# Altium schematic sheet УШЯИ.411522.033Э3_2.SCHDOC
size 420 x 297 mm; SheetNumber: 2; SheetTotal: 5; DocumentName: Sheet1.SCHDOC
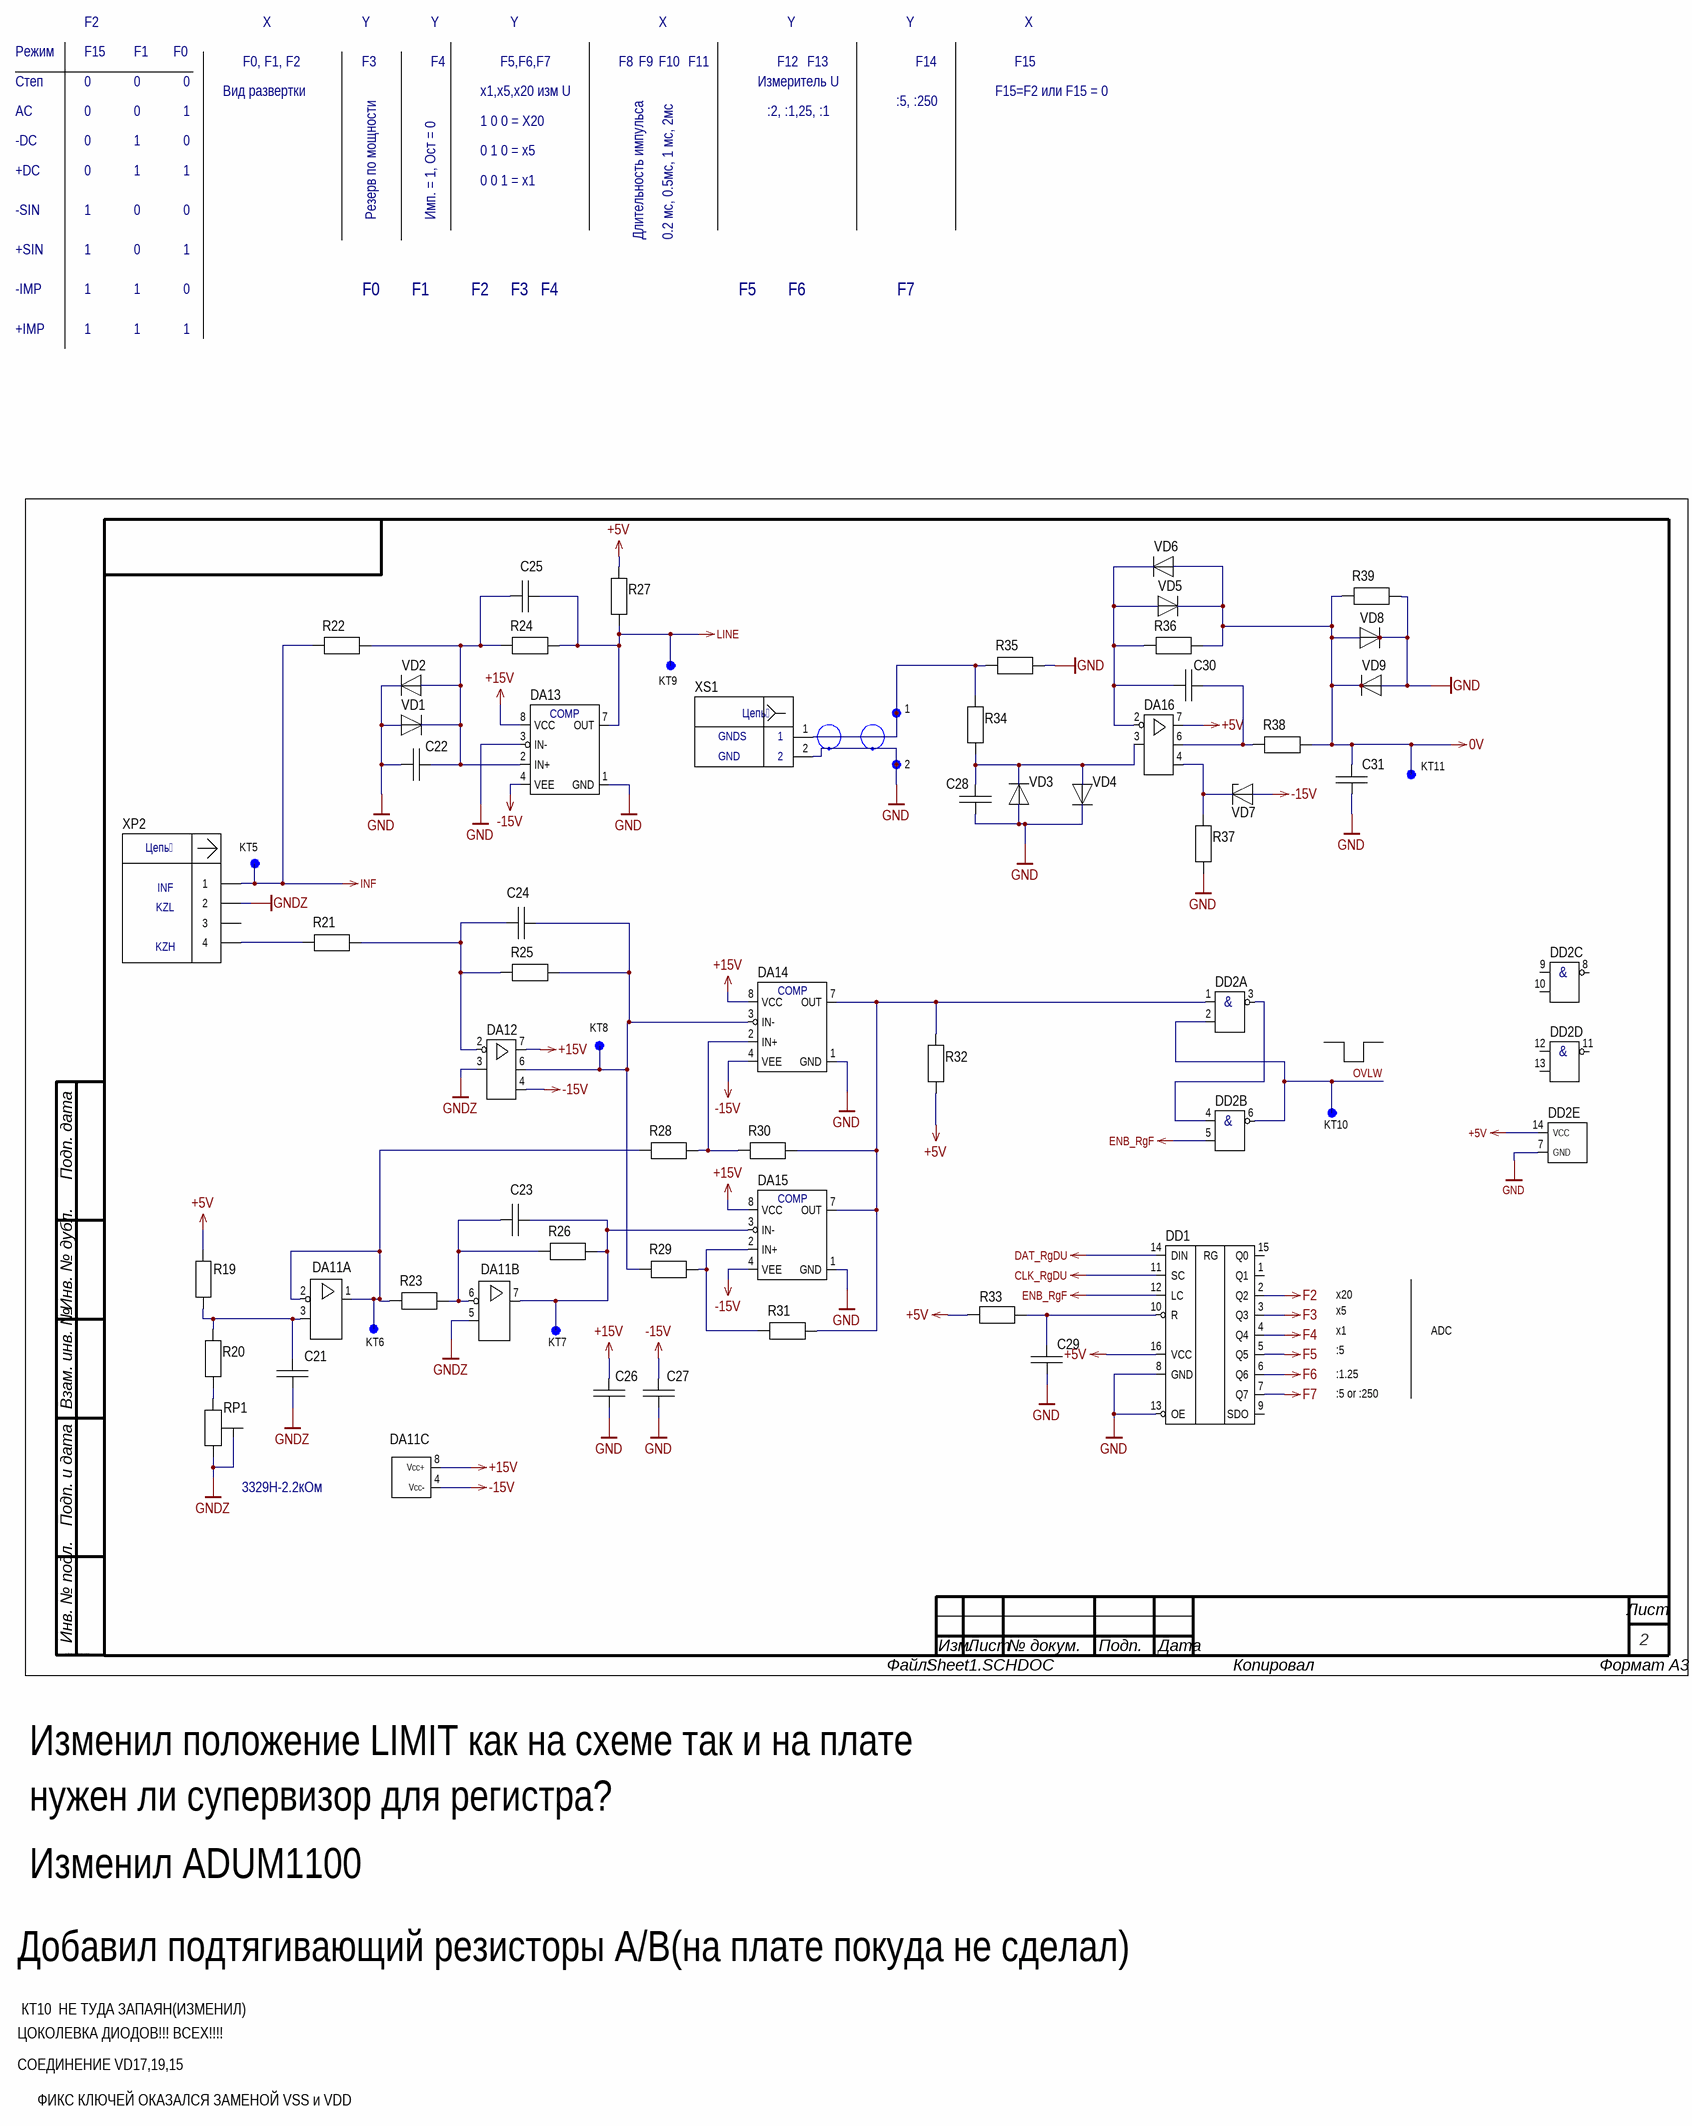
[diagram p0: УШЯИ.411522.033Э3_2.SCHDOC]

## Parts
1  OTV10  [OTV10]  (value not drawn)  (no BOM)
2  OTV10  [OTV10]  (value not drawn)  (no BOM)
C21  1206-X7R-50 B-0,01 мкФ+-10%  [CAP: 1206]  (value not drawn)
C22  1206-X7R-50 B-1 нФ+-10%  [CAP: 1206]  (value not drawn)
C23  1206-X7R-50 B-5600 пФ+-10%  [CAP: 1206]  (value not drawn)
C24  1206-X7R-50 B-510 пФ+-10%  [CAP: 1206]  (value not drawn)
C25  1206-X7R-50 B-51 пФ+-10%  [CAP: 1206]  (value not drawn)
C26  1206-X7R-50 B-0,33 мкФ+-10%  [CAP: 1206]  (value not drawn)
C27  1206-X7R-50 B-0,33 мкФ+-10%  [CAP: 1206]  (value not drawn)
C28  1206-X7R-50 B-100 пФ+-10%  [CAP: 1206]  (value not drawn)
C29  1206-X7R-50 B-0,33 мкФ+-10%  [CAP: 1206]  (value not drawn)
C30  1206-X7R-50 B-240 пФ+-10%  [CAP: 1206]  (value not drawn)
C31  1206-X7R-50 B-100 пФ+-10%  [CAP: 1206]  (value not drawn)
DA11  IL358D  [8-SOIC]  (value not drawn)  (parts A,B,C of 3)
DA12  AD8671AR  [8-SOIC]  (value not drawn)
DA13  IL311D  [8-SOIC]  (value not drawn)
DA14  IL311D  [8-SOIC]  (value not drawn)
DA15  IL311D  [8-SOIC]  (value not drawn)
DA16  AD8671AR  [8-SOIC]  (value not drawn)
DD1  IN74HC595AD  [16-SOIC]  (value not drawn)
DD2  IN74HC00AD  [14-soic]  (value not drawn)  (parts A,B,C,D,E of 5)
KT5  OTV10  [OTV10]  (value not drawn)  (no BOM)
KT6  OTV10  [OTV10]  (value not drawn)  (no BOM)
KT7  OTV10  [OTV10]  (value not drawn)  (no BOM)
KT8  OTV10  [OTV10]  (value not drawn)  (no BOM)
KT9  OTV10  [OTV10]  (value not drawn)  (no BOM)
KT10  OTV10  [OTV10]  (value not drawn)  (no BOM)
KT11  OTV10  [OTV10]  (value not drawn)  (no BOM)
R19  1206-7,5 кОм+-5%  [1206]  (value not drawn)
R20  1206-2,2 кОм+-5%  [1206]  (value not drawn)
R21  1206-10 кОм+-0,5%  [1206]  (value not drawn)
R22  1206-15 кОм+-5%  [1206]  (value not drawn)
R23  1206-10 кОм+-0,5%  [1206]  (value not drawn)
R24  1206-3 МОм+-5%  [1206]  (value not drawn)
R25  1206-10 кОм+-0,5%  [1206]  (value not drawn)
R26  1206-10 кОм+-0,5%  [1206]  (value not drawn)
R27  1206-1,5 кОм+-5%  [1206]  (value not drawn)
R28  1206-120 Ом+-5%  [1206]  (value not drawn)
R29  1206-120 Ом+-5%  [1206]  (value not drawn)
R30  1206-560 кОм+-5%  [1206]  (value not drawn)
R31  1206-560 кОм+-5%  [1206]  (value not drawn)
R32  1206-5,1 кОм+-5%  [1206]  (value not drawn)
R33  1206-51 кОм+-5%  [1206]  (value not drawn)
R34  1206-100 Ом+-5%  [1206]  (value not drawn)
R35  1206-12 кОм+-5%  [1206]  (value not drawn)
R36  1206-1,1 кОм+-5%  [1206]  (value not drawn)
R37  1206-2,4 кОм+-5%  [1206]  (value not drawn)
R38  1206-15 Ом+-5%  [1206]  (value not drawn)
R39  1206-330 Ом+-5%  [1206]  (value not drawn)
RP1  3329H-1-222LF  [3329H]  (value not drawn)
VD1  1N4148WS  [SOD-323F]  (value not drawn)
VD2  1N4148WS  [SOD-323F]  (value not drawn)
VD3  1N4148WS  [SOD-323F]  (value not drawn)
VD4  1N4148WS  [SOD-323F]  (value not drawn)
VD5  1N4148WS  [SOD-323F]  (value not drawn)
VD6  1N4148WS  [SOD-323F]  (value not drawn)
VD7  BZX55-C10  [DO-35]  (value not drawn)
VD8  1N4001WS  [SOD-323]  (value not drawn)
VD9  1N4001WS  [SOD-323]  (value not drawn)
XP2  280371-2  [280371-2]  (value not drawn)
XS1  280358-0  (value not drawn)

## Nets
0V: C31.2 KT11.1 R36.2 R38.2 R39.1 VD5.1 VD6.2 VD8.2 VD9.1
+5V: DA16.7(V+) DD1.16(VCC) DD2.14(VCC) R19.2 R27.2 R32.2 R33.1
+15V: C26.2 DA11.8(Vcc+) DA12.7(V+) DA13.8(VCC) DA14.8(VCC) DA15.8(VCC)
-15V: C27.2 DA11.4(Vcc-) DA12.4(V-) DA13.4(VEE) DA14.4(VEE) DA15.4(VEE) VD7.2
CLK_RgDU: DD1.11(SC)
DAT_RgDU: DD1.14(DIN)
ENB_RgF: DD1.12(LC) DD2.5(B2)
F2: DD1.2(Q2)
F3: DD1.3(Q3)
F4: DD1.4(Q4)
F5: DD1.5(Q5)
F6: DD1.6(Q6)
F7: DD1.7(Q7)
GND: 2.?1 C22.1 C26.1 C27.1 C28.1 C29.1 C31.1 DA13.1(GND) DA13.3(IN-) DA14.1(GND) DA15.1(GND) DD1.8(GND) DD1.13(OE) DD2.7(GND) R35.2 R37.1 R39.2 VD1.2 VD2.1 VD3.2 VD4.1 VD8.1 VD9.2 XS1.2
GNDZ: C21.1 DA11.5(+IN_B) DA12.3(+IN) RP1.2(WIPER) RP1.3(CW) XP2.2
INF: KT5.1 R22.1 XP2.1
LINE: C25.2 DA13.7(OUT) KT9.1 R24.2 R27.1
OVLW: DD2.2(B1) DD2.6(Y2) KT10.1
Net1_?1: 1.?1 R34.2 R35.1 XS1.1
NetC21_2: C21.2 DA11.3(+IN_A) R19.1 R20.1
NetC22_2: C22.2 C25.1 DA13.2(IN+) R22.2 R24.1 VD1.1 VD2.2
NetC23_1: C23.1 DA11.6(-IN_B) R23.2 R26.1
NetC23_2: C23.2 DA11.7(OUT_B) DA15.3(IN-) KT7.1 R26.2
NetC24_1: C24.1 DA12.2(-IN) R21.2 R25.1
NetC24_2: C24.2 DA12.6(OUT) DA14.3(IN-) KT8.1 R25.2 R29.1
NetC28_2: C28.2 DA16.3(+IN) R34.1 VD3.1 VD4.2
NetC29_2: C29.2 DD1.10(R) R33.2
NetC30_1: C30.1 DA16.2(-IN) R36.1 VD5.2 VD6.1
NetC30_2: C30.2 DA16.6(OUT) R38.1
NetDA11_1: DA11.1(OUT_A) DA11.2(-IN_A) KT6.1 R23.1 R28.1
NetDA14_2: DA14.2(IN+) R28.2 R30.1
NetDA14_7: DA14.7(OUT) DA15.7(OUT) DD2.1(A1) R30.2 R31.2 R32.1
NetDA15_2: DA15.2(IN+) R29.2 R31.1
NetDA16_4: DA16.4(V-) R37.2 VD7.1
NetDD2_3: DD2.3(Y1) DD2.4(A2)
NetR20_2: R20.2 RP1.1(CCW)
NetR21_1: R21.1 XP2.4

Not connected (* = marked no-connect by the designer): DD1 1(Q1) 9(SDO) 15(Q0); DD2 8(Y3) 9(A3) 10(B3) 11(Y4) 12(A4) 13(B4); XP2 3

## Notes on the sheet
- F2
- X
- Y
- Режим
- F15
- F1
- F0
- F0, F1, F2
- F3
- F4
- F5,F6,F7
- F8
- F9
- F10
- F11
- F12
- F13
- F14
- Степ
- AC
- 0
- 1
- Вид развертки
- x1,x5,x20 изм U
- 1 0 0 = X20
- Измеритель U
- :2, :1,25, :1
- :5, :250
- F15=F2 или F15 = 0
- -DC
- +DC
- 0 1 0 = x5
- 0 0 1 = x1
- -SIN
- Резерв по мощности
- Имп. = 1, Ост = 0
- Длительность импульса
- 0.2 мс, 0.5мс, 1 мс, 2мс
- +SIN
- F5
- F6
- F7
- -IMP
- +IMP
- GNDS
- (near XS1) 1
- GND
- (near XS1) 2
- INF
- KZL
- KZH
- x20
- x5
- x1
- ADC
- :1.25
- :5
- :5 or :250
- (near RP1) 3329H-2.2кОм
- Изменил положение LIMIT как на схеме так и на плате
- нужен ли супервизор для регистра?
- Изменил ADUM1100
- Добавил подтягивающий резисторы A/B(на плате покуда не сделал)
- ЦОКОЛЕВКА ДИОДОВ!!! ВСЕХ!!!!
- КТ10  НЕ ТУДА ЗАПАЯН(ИЗМЕНИЛ)
- СОЕДИНЕНИЕ VD17,19,15
- ФИКС КЛЮЧЕЙ ОКАЗАЛСЯ ЗАМЕНОЙ VSS и VDD
- Подп. дата
- Инв. № дубл.
- Взам. инв. №
- Подп. и дата
- Инв. № подл.
- Изм.
- Лист
- № докум.
- Подп.
- Дата
- ALTIUM GOSTBOM2.0 KEV
- Файл:
- Копировал
- Формат А3
- (in symbol 280358-0) Цепь
- (in symbol 280371-2) Цепь
- (in symbol IL311D) COMP
- (in symbol IN74HC00AD, part A) &
- (in symbol IN74HC00AD, part B) &
- (in symbol IN74HC00AD, part C) &
- (in symbol IN74HC00AD, part D) &
- (in symbol IN74HC595AD) RG

## Library data of the parts
C22 = 1206-X7R-50 B-1 нФ+-10%: Value: 1 нФ
C23 = 1206-X7R-50 B-5600 пФ+-10%: Value: 5600 пФ
C24 = 1206-X7R-50 B-510 пФ+-10%: Value: 510 пФ
C25 = 1206-X7R-50 B-51 пФ+-10%: Value: 51 пФ
C28 C31 = 1206-X7R-50 B-100 пФ+-10%: Value: 100 пФ
C30 = 1206-X7R-50 B-240 пФ+-10%: Value: 240 пФ
DA11 = IL358D: Ultraprecision, 36 V, 2.8 nV/√Hz / Dual Rail-to-Rail Output Op Amp
DA12 DA16 = AD8671AR: Bias Current Operational Amplifiers, Precision, Very Low Noise, Low Input
DA13-DA15 = IL311D: High Perfomance Voltage Comparartor; Value: *
DD1 = IN74HC595AD: 8-Bit SIPO Register w/ Latch & 3-State
DD2 = IN74HC00AD: Quad 2-Input NAND Gate High-Performance Silicon-Gate CMOS.
R19 = 1206-7,5 кОм+-5%: Value: 7,5 кОм; ModelPrint: 1206
R20 = 1206-2,2 кОм+-5%: Value: 2,2 кОм; ModelPrint: 1206
R21 R23 R25 R26 = 1206-10 кОм+-0,5%: Value: 10 кОм; ModelPrint: 1206
R22 = 1206-15 кОм+-5%: Value: 15 кОм; ModelPrint: 1206
R24 = 1206-3 МОм+-5%: Value: 3 МОм; ModelPrint: 1206
R27 = 1206-1,5 кОм+-5%: Value: 1,5 кОм; ModelPrint: 1206
R28 R29 = 1206-120 Ом+-5%: Value: 120 Ом; ModelPrint: 1206
R30 R31 = 1206-560 кОм+-5%: Value: 560 кОм; ModelPrint: 1206
R32 = 1206-5,1 кОм+-5%: Value: 5,1 кОм; ModelPrint: 1206
R33 = 1206-51 кОм+-5%: Value: 51 кОм; ModelPrint: 1206
R34 = 1206-100 Ом+-5%: Value: 100 Ом; ModelPrint: 1206
R35 = 1206-12 кОм+-5%: Value: 12 кОм; ModelPrint: 1206
R36 = 1206-1,1 кОм+-5%: Value: 1,1 кОм; ModelPrint: 1206
R37 = 1206-2,4 кОм+-5%: Value: 2,4 кОм; ModelPrint: 1206
R38 = 1206-15 Ом+-5%: Value: 15 Ом; ModelPrint: 1206
R39 = 1206-330 Ом+-5%: Value: 330 Ом; ModelPrint: 1206
RP1 = 3329H-1-222LF: Variable Resistor 2.2kOm
VD1-VD6 = 1N4148WS: Small Signal Fast Switching Diod; Value: *
VD7 = BZX55-C10: Стабилитрон BZX55-C10; Value: *
VD8 VD9 = 1N4001WS: General Purpose Plastic Rectifier; Value: *
XP2 = 280371-2: Connector
XS1 = 280358-0: TE Connectivity 2,54mm / for wire
C21 = 1206-X7R-50 B-0,01 мкФ+-10%: Value: 0,01 мкФ
C26 C27 C29 = 1206-X7R-50 B-0,33 мкФ+-10%: Value: 0,33 мкФ